# Altium schematic sheet mcu.SchDoc
size 431 x 279 mm
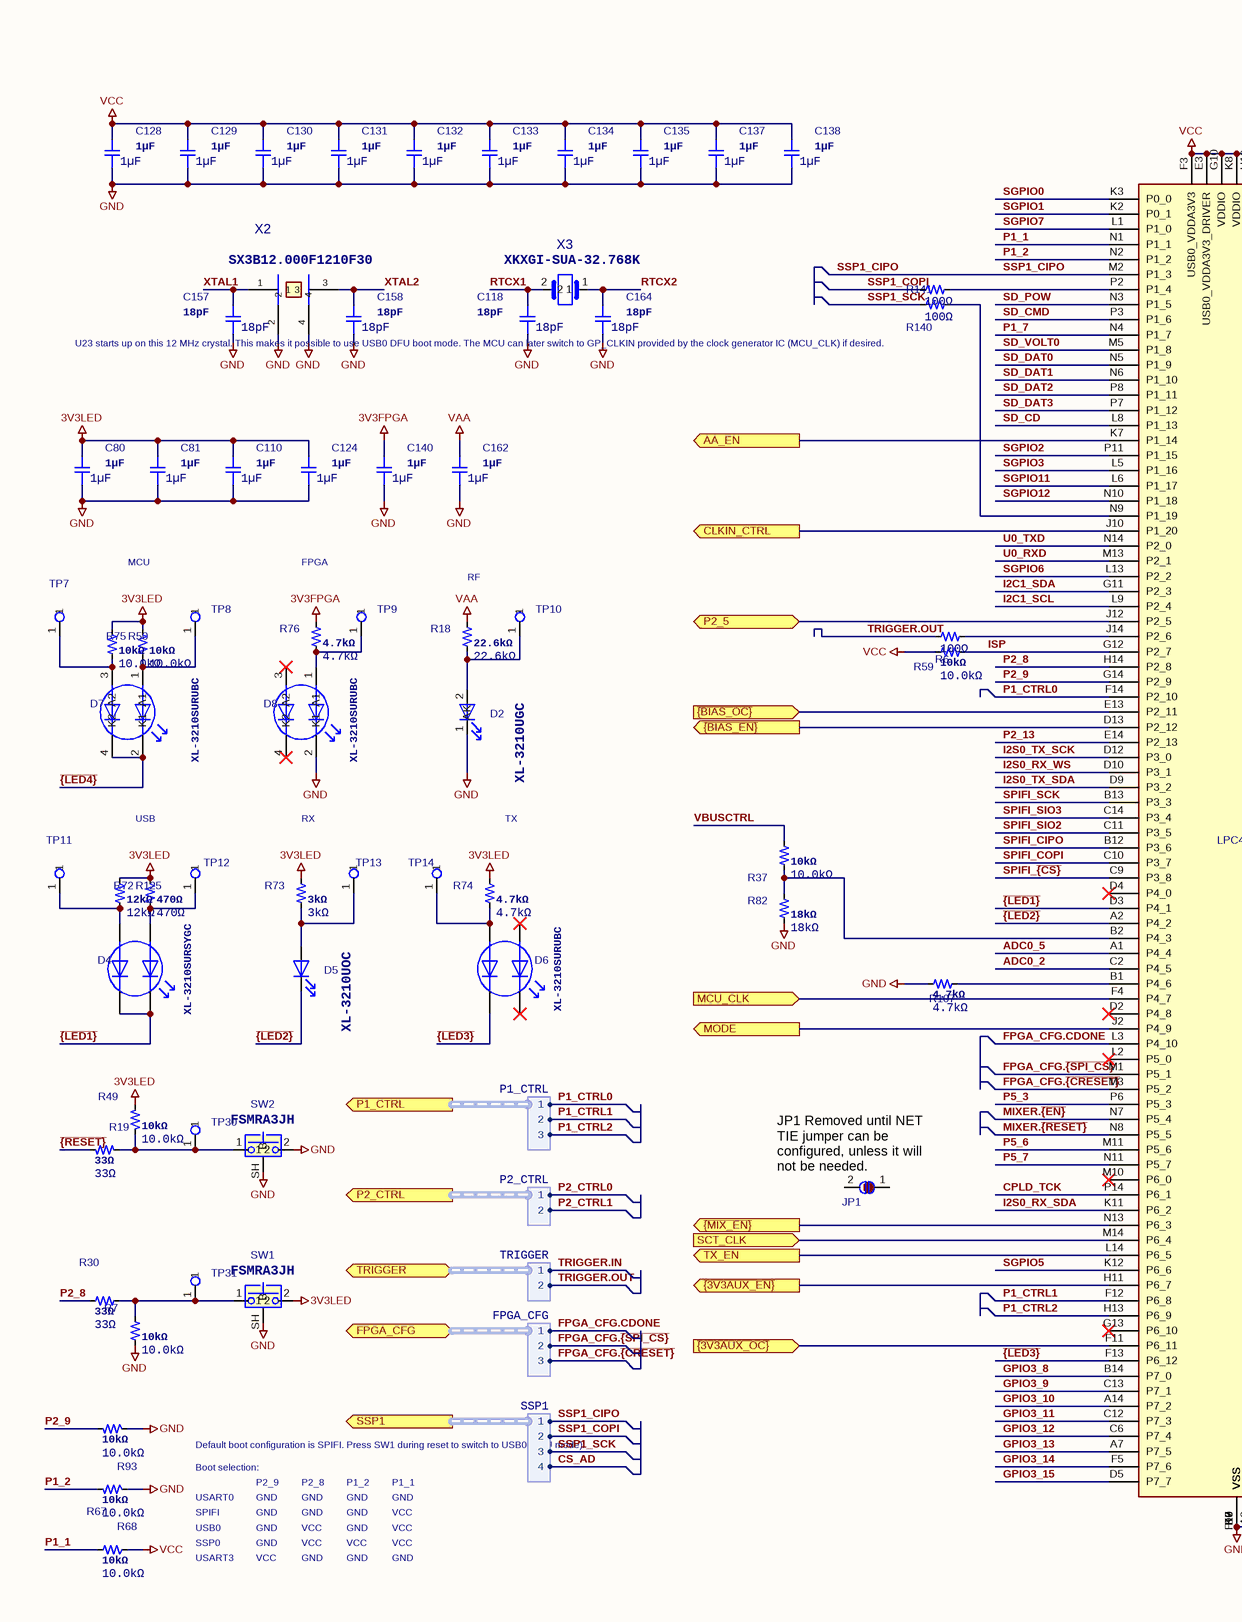
[diagram p0: mcu.SchDoc, left]
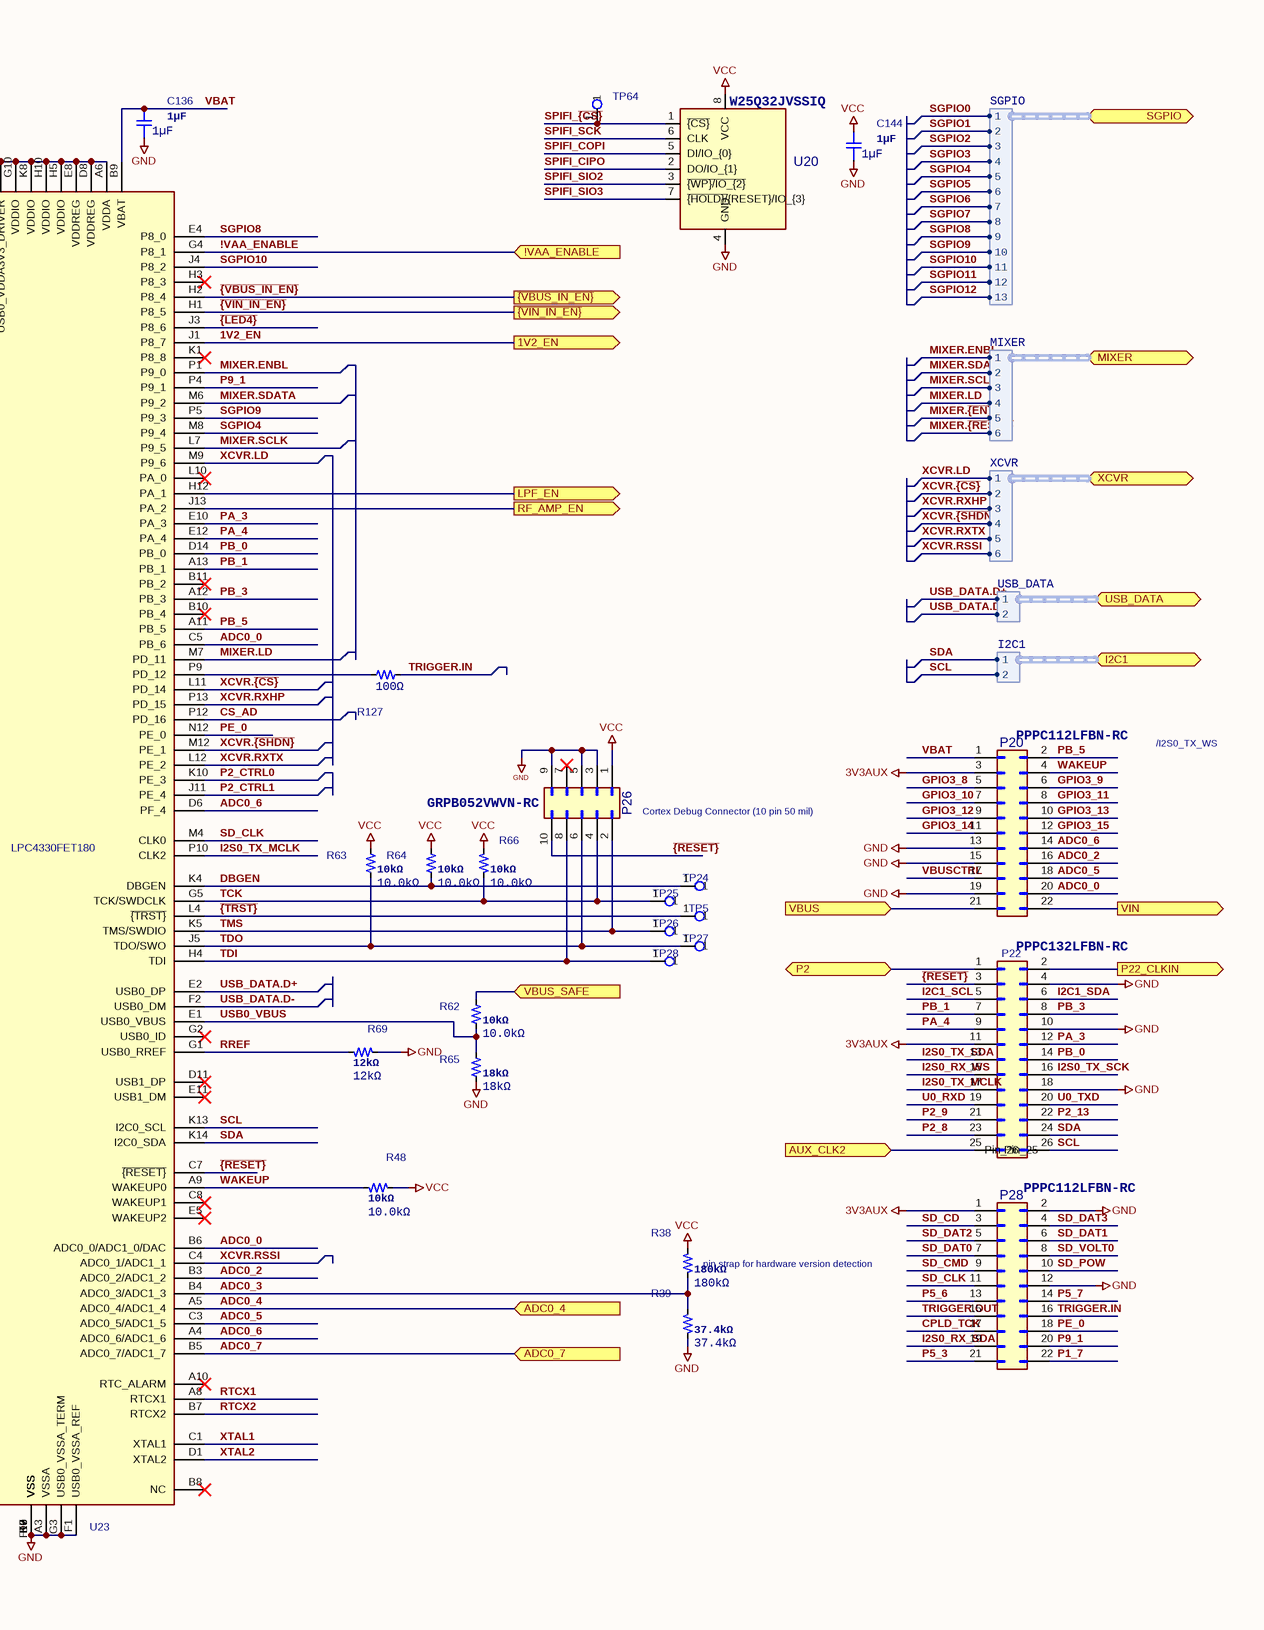
[diagram p1: mcu.SchDoc, right]

## Parts
C80  value 1µF  [CAPC0402(1005)33_L]  (hidden comment: MN-CAP-CERM-X7R-0402-1µF-25V-10%)
C81  value 1µF  [CAPC0402(1005)33_L]  (hidden comment: MN-CAP-CERM-X7R-0402-1µF-25V-10%)
C110  value 1µF  [CAPC0402(1005)33_L]  (hidden comment: MN-CAP-CERM-X7R-0402-1µF-25V-10%)
C118  value 18pF  [CAPC0402(1005)33_L]  (hidden comment: MN-CAP-CERM-C0G-0402-18pF-50V-5%)
C124  value 1µF  [CAPC0402(1005)33_L]  (hidden comment: MN-CAP-CERM-X7R-0402-1µF-25V-10%)
C128  value 1µF  [CAPC0402(1005)33_L]  (hidden comment: MN-CAP-CERM-X7R-0402-1µF-25V-10%)
C129  value 1µF  [CAPC0402(1005)33_L]  (hidden comment: MN-CAP-CERM-X7R-0402-1µF-25V-10%)
C130  value 1µF  [CAPC0402(1005)33_L]  (hidden comment: MN-CAP-CERM-X7R-0402-1µF-25V-10%)
C131  value 1µF  [CAPC0402(1005)33_L]  (hidden comment: MN-CAP-CERM-X7R-0402-1µF-25V-10%)
C132  value 1µF  [CAPC0402(1005)33_L]  (hidden comment: MN-CAP-CERM-X7R-0402-1µF-25V-10%)
C133  value 1µF  [CAPC0402(1005)33_L]  (hidden comment: MN-CAP-CERM-X7R-0402-1µF-25V-10%)
C134  value 1µF  [CAPC0402(1005)33_L]  (hidden comment: MN-CAP-CERM-X7R-0402-1µF-25V-10%)
C135  value 1µF  [CAPC0402(1005)33_L]  (hidden comment: MN-CAP-CERM-X7R-0402-1µF-25V-10%)
C136  value 1µF  [CAPC0402(1005)33_L]  (hidden comment: MN-CAP-CERM-X7R-0402-1µF-25V-10%)
C137  value 1µF  [CAPC0402(1005)33_L]  (hidden comment: MN-CAP-CERM-X7R-0402-1µF-25V-10%)
C138  value 1µF  [CAPC0402(1005)33_L]  (hidden comment: MN-CAP-CERM-X7R-0402-1µF-25V-10%)
C140  value 1µF  [CAPC0402(1005)33_L]  (hidden comment: MN-CAP-CERM-X7R-0402-1µF-25V-10%)
C144  value 1µF  [CAPC0402(1005)33_L]  (hidden comment: MN-CAP-CERM-X7R-0402-1µF-25V-10%)
C157  value 18pF  [CAPC0402(1005)33_L]  (hidden comment: MN-CAP-CERM-C0G-0402-18pF-50V-5%)
C158  value 18pF  [CAPC0402(1005)33_L]  (hidden comment: MN-CAP-CERM-C0G-0402-18pF-50V-5%)
C162  value 1µF  [CAPC0402(1005)33_L]  (hidden comment: MN-CAP-CERM-X7R-0402-1µF-25V-10%)
C164  value 18pF  [CAPC0402(1005)33_L]  (hidden comment: MN-CAP-CERM-C0G-0402-18pF-50V-5%)
D2  Part Number: XL-3210UGC  [LED_Single_Xinglight_XL-3210_Horizontal]  (hidden comment: LED)
D4  Part Number: XL-3210SURSYGC  [LED_Dual_Xinglight_XL-3210_Horizontal]  (hidden comment: LED)
D5  Part Number: XL-3210UOC  [LED_Single_Xinglight_XL-3210_Horizontal]  (hidden comment: LED)
D6  Part Number: XL-3210SURUBC  [LED_Dual_Xinglight_XL-3210_Horizontal]  (hidden comment: LED)
D7  Part Number: XL-3210SURUBC  [LED_Dual_Xinglight_XL-3210_Horizontal]  (hidden comment: LED)
D8  Part Number: XL-3210SURUBC  [LED_Dual_Xinglight_XL-3210_Horizontal]  (hidden comment: LED)
JP1  SolderJumper_2_Bridged  [SolderJumper-2_P1.3mm_Bridged_RoundedPad1.0x1.5mm]  (value not drawn)  (graphical)
P20  Part Number: PPPC112LFBN-RC  [PinSocket_2x11_P2.54mm_Vertical_Flipped]  (hidden comment: HEADER_2x11)
P22  Part Number: PPPC132LFBN-RC  [PinSocket_2x13_P2.54mm_Vertical_Flipped]  (hidden comment: HEADER_2x13)
P26  Part Number: GRPB052VWVN-RC  [PinHeader_2x05_P1.27mm_Vertical]  (hidden comment: LPC_JTAG)
P28  Part Number: PPPC112LFBN-RC  [PinSocket_2x11_P2.54mm_Vertical_Flipped]  (hidden comment: HEADER_2x11)
R6  Resistance: 100Ω  [RESC0201(0603)_N]  (hidden comment: MN-RES-0201-100Ω-1/20W)
R7  value 10kΩ  Resistance: 10.0kΩ  [RESC0402(1005)]  (hidden comment: MN-RES-0402-10.0KΩ-1/5W)
R18  value 22.6kΩ  [RESC0201(0603)_N]  (hidden comment: MN-RES-0201-22.6KΩ-1/20W)
R19  value 33Ω  [RESC0201(0603)_N]  (hidden comment: MN-RES-0201-33Ω-1/20W)
R30  value 33Ω  [RESC0201(0603)_N]  (hidden comment: MN-RES-0201-33Ω-1/20W)
R37  value 10kΩ  Resistance: 10.0kΩ  [RESC0402(1005)]  (hidden comment: MN-RES-0402-10.0KΩ-1/5W)
R38  value 180kΩ  [RESC0402(1005)]  (hidden comment: MN-RES-0402-180KΩ-1/16W)
R39  value 37.4kΩ  [RESC0402(1005)]  (hidden comment: MN-RES-0402-37.4KΩ-1/16W)
R48  value 10kΩ  Resistance: 10.0kΩ  [RESC0402(1005)]  (hidden comment: MN-RES-0402-10.0KΩ-1/5W)
R49  value 10kΩ  Resistance: 10.0kΩ  [RESC0402(1005)]  (hidden comment: MN-RES-0402-10.0KΩ-1/5W)
R50  value 10kΩ  Resistance: 10.0kΩ  [RESC0402(1005)]  (hidden comment: MN-RES-0402-10.0KΩ-1/5W)
R59  value 10kΩ  Resistance: 10.0kΩ  [RESC0402(1005)]  (hidden comment: MN-RES-0402-10.0KΩ-1/5W)
R62  value 10kΩ  Resistance: 10.0kΩ  [RESC0402(1005)]  (hidden comment: MN-RES-0402-10.0KΩ-1/5W)
R63  value 10kΩ  Resistance: 10.0kΩ  [RESC0402(1005)]  (hidden comment: MN-RES-0402-10.0KΩ-1/5W)
R64  value 10kΩ  Resistance: 10.0kΩ  [RESC0402(1005)]  (hidden comment: MN-RES-0402-10.0KΩ-1/5W)
R65  value 18kΩ  [RESC0402(1005)]  (hidden comment: MN-RES-0402-18KΩ-1/16W)
R66  value 10kΩ  Resistance: 10.0kΩ  [RESC0402(1005)]  (hidden comment: MN-RES-0402-10.0KΩ-1/5W)
R67  value 10kΩ  Resistance: 10.0kΩ  [RESC0402(1005)]  (hidden comment: MN-RES-0402-10.0KΩ-1/5W)
R68  value 10kΩ  Resistance: 10.0kΩ  [RESC0402(1005)]  (hidden comment: MN-RES-0402-10.0KΩ-1/5W)
R69  value 12kΩ  [RESC0201(0603)_N]  (hidden comment: MN-RES-0201-12KΩ-1/20W)
R72  value 470Ω  [RESC0201(0603)_N]  (hidden comment: MN-RES-0201-470Ω-1/20W)
R73  value 3kΩ  [RESC0402(1005)]  (hidden comment: MN-RES-0402-3KΩ-1/16W)
R74  value 4.7kΩ  [RESC0201(0603)_N]  (hidden comment: MN-RES-0201-4.7KΩ-1/20W)
R75  value 10kΩ  Resistance: 10.0kΩ  [RESC0402(1005)]  (hidden comment: MN-RES-0402-10.0KΩ-1/5W)
R76  value 4.7kΩ  [RESC0201(0603)_N]  (hidden comment: MN-RES-0201-4.7KΩ-1/20W)
R82  value 18kΩ  [RESC0402(1005)]  (hidden comment: MN-RES-0402-18KΩ-1/16W)
R93  value 10kΩ  Resistance: 10.0kΩ  [RESC0402(1005)]  (hidden comment: MN-RES-0402-10.0KΩ-1/5W)
R107  value 4.7kΩ  [RESC0201(0603)_N]  (hidden comment: MN-RES-0201-4.7KΩ-1/20W)
R125  value 12kΩ  [RESC0201(0603)_N]  (hidden comment: MN-RES-0201-12KΩ-1/20W)
R127  Resistance: 100Ω  [RESC0201(0603)_N]  (hidden comment: MN-RES-0201-100Ω-1/20W)
R140  Resistance: 100Ω  [RESC0201(0603)_N]  (hidden comment: MN-RES-0201-100Ω-1/20W)
R141  Resistance: 100Ω  [RESC0201(0603)_N]  (hidden comment: MN-RES-0201-100Ω-1/20W)
SW1  Part Number: FSMRA3JH  [SW_Tactile_SPST_Angled_PTS645Vx58-2LFS]  (hidden comment: SWITCH)
SW2  Part Number: FSMRA3JH  [SW_Tactile_SPST_Angled_PTS645Vx58-2LFS]  (hidden comment: SWITCH)
TP5  TestPoint  [TestPoint_Pad_D1.0mm]  (value not drawn)
TP7  TestPoint  [TestPoint_Pad_D1.0mm]  (value not drawn)
TP8  TestPoint  [TestPoint_Pad_D1.0mm]  (value not drawn)
TP9  TestPoint  [TestPoint_Pad_D1.0mm]  (value not drawn)
TP10  TestPoint  [TestPoint_Pad_D1.0mm]  (value not drawn)
TP11  TestPoint  [TestPoint_Pad_D1.0mm]  (value not drawn)
TP12  TestPoint  [TestPoint_Pad_D1.0mm]  (value not drawn)
TP13  TestPoint  [TestPoint_Pad_D1.0mm]  (value not drawn)
TP14  TestPoint  [TestPoint_Pad_D1.0mm]  (value not drawn)
TP24  TestPoint  [TestPoint_Pad_D1.0mm]  (value not drawn)
TP25  TestPoint  [TestPoint_Pad_D1.0mm]  (value not drawn)
TP26  TestPoint  [TestPoint_Pad_D1.0mm]  (value not drawn)
TP27  TestPoint  [TestPoint_Pad_D1.0mm]  (value not drawn)
TP28  TestPoint  [TestPoint_Pad_D1.0mm]  (value not drawn)
TP30  TestPoint  [TestPoint_Pad_D1.0mm]  (value not drawn)
TP31  TestPoint  [TestPoint_Pad_D1.0mm]  (value not drawn)
TP64  TestPoint  [TestPoint_Pad_D1.0mm]  (value not drawn)
U20  Part Number: W25Q32JVSSIQ  [SOIC-8_5.3x5.3mm_P1.27mm]  (hidden comment: W25Q32)
U23  LPC4330FET180  [TFBGA-180_12x12mm_Layout14x14_P0.8mm]
X2  Part Number: SX3B12.000F1210F30  [Crystal_SMD_3225-4Pin_3.2x2.5mm]  (hidden comment: MCU_XTAL)
X3  Part Number: XKXGI-SUA-32.768K  [Crystal_SMD_3215-2Pin_3.2x1.5mm]  (hidden comment: RTC_XTAL)

## Ports
1V2_EN (out), !VAA_ENABLE (in), AA_EN (out), ADC0_4 (in), ADC0_7 (in), AUX_CLK2 (in), CLKIN_CTRL (out), FPGA_CFG (bidir, harness FPGA_CFG), I2C1 (bidir, harness I2C1), LPF_EN (out), MCU_CLK (in), MIXER (bidir, harness MIXER), MODE (out), P1_CTRL (out, harness P1_CTRL), P2 (bidir), P2_5 (bidir), P2_CTRL (out, harness P2_CTRL), P22_CLKIN (out), RF_AMP_EN (out), SCT_CLK (in), SGPIO (bidir, harness SGPIO), SSP1 (out, harness SSP1), TRIGGER (bidir, harness TRIGGER), TX_EN (out), USB_DATA (bidir, harness USB_DATA), VBUS (in), VBUS_SAFE (in), VIN (out), XCVR (bidir, harness XCVR), ~{{3V3AUX_EN}} (out), ~{{3V3AUX_OC}} (in), ~{{BIAS_EN}} (out), ~{{BIAS_OC}} (in), ~{{MIX_EN}} (out), ~{{VBUS_IN_EN}} (out), ~{{VIN_IN_EN}} (out)

## Harnesses
XCVR: 1, 5, 4, 3, 2, 6
MIXER: 1, 6, 5, 4, 3, 2
USB_DATA: 1, 2
SGPIO: 1, 5, 4, 3, 2, 13, 7, 8, 11, 9, 12, 10, 6
P1_CTRL: 1, 2, 3
P2_CTRL: 1, 2
TRIGGER: 1, 2
FPGA_CFG: 1, 2, 3
SSP1: 1, 2, 3, 4
I2C1: 1, 2

## Nets
3V3AUX: P20.3(Pin_3) P22.11(Pin_11) P28.1(Pin_1)
3V3FPGA: C140.1 R76.1
3V3LED: C80.1 C81.1 C110.1 C124.1 R49.1 R50.1 R72.1 R73.1 R74.1 R75.1 R125.1 SW1.2
GND: C80.2 C81.2 C110.2 C118.2 C124.2 C128.2 C129.2 C130.2 C131.2 C132.2 C133.2 C134.2 C135.2 C136.2 C137.2 C138.2 C140.2 C144.2 C157.2 C158.2 C162.2 C164.2 D2.1(K) D8.2(K1) P20.13(Pin_13) P20.15(Pin_15) P20.19(Pin_19) P22.4(Pin_4) P22.10(Pin_10) P22.18(Pin_18) P26.3(Pin_3) P26.5(Pin_5) P26.9(Pin_9) P28.2(Pin_2) P28.12(Pin_12) R7.2 R39.2 R65.2 R68.1 R69.1 R82.2 R93.1 R107.1 SW1.SH(B) SW2.2 SW2.SH(B) U20.4(GND) U23.A3(VSSA) U23.D7(VSS) U23.E6(VSS) U23.E7(VSS) U23.E9(VSS) U23.F1(USB0_VSSA_REF) U23.F10(VSS) U23.G3(USB0_VSSA_TERM) U23.K6(VSS) U23.K9(VSS) X2.2 X2.4
VAA: C162.1 R18.1
VCC: C128.1 C129.1 C130.1 C131.1 C132.1 C133.1 C134.1 C135.1 C137.1 C138.1 C144.1 P26.1(Pin_1) R38.1 R48.1 R59.1 R63.1 R64.1 R66.1 R67.2 U20.8(VCC) U23.A6(VDDA) U23.D8(VDDREG) U23.E3(USB0_VDDA3V3_DRIVER) U23.E8(VDDREG) U23.F3(USB0_VDDA3V3) U23.G10(VDDIO) U23.H5(VDDIO) U23.H10(VDDIO) U23.K8(VDDIO)
1V2_EN: U23.J1(P8_7) ; port 1V2_EN
!VAA_ENABLE: U23.G4(P8_1) ; port !VAA_ENABLE
AA_EN: U23.K7(P1_14) ; port AA_EN
ADC0_0: P20.20(Pin_20) U23.B6(ADC0_0/ADC1_0/DAC) U23.C5(PB_6)
ADC0_2: P20.16(Pin_16) U23.B3(ADC0_2/ADC1_2) U23.C2(P4_5)
ADC0_3: R38.2 R39.1 U23.B4(ADC0_3/ADC1_3)
ADC0_4: U23.A5(ADC0_4/ADC1_4) ; port ADC0_4
ADC0_5: P20.18(Pin_18) U23.A1(P4_4) U23.C3(ADC0_5/ADC1_5)
ADC0_6: P20.14(Pin_14) U23.A4(ADC0_6/ADC1_6) U23.D6(PF_4)
ADC0_7: U23.B5(ADC0_7/ADC1_7) ; port ADC0_7
AUX_CLK2: P22.25(Pin_25) ; port AUX_CLK2
CLKIN_CTRL: U23.J10(P1_20) ; port CLKIN_CTRL
CPLD_TCK: P28.17(Pin_17) U23.P14(P6_1)
CS_AD: U23.P12(PD_16) ; port SSP1.4
DBGEN: R64.2 TP24.1 U23.K4(DBGEN)
FPGA_CFG.CDONE: U23.L3(P4_10) ; port FPGA_CFG.1
FPGA_CFG.~{{CRESET}}: U23.M3(P5_2) ; port FPGA_CFG.3
FPGA_CFG.~{{SPI_CS}}: U23.M1(P5_1) ; port FPGA_CFG.2
GPIO3_8: P20.5(Pin_5) U23.B14(P7_0)
GPIO3_9: P20.6(Pin_6) U23.C13(P7_1)
GPIO3_10: P20.7(Pin_7) U23.A14(P7_2)
GPIO3_11: P20.8(Pin_8) U23.C12(P7_3)
GPIO3_12: P20.9(Pin_9) U23.C6(P7_4)
GPIO3_13: P20.10(Pin_10) U23.A7(P7_5)
GPIO3_14: P20.11(Pin_11) U23.F5(P7_6)
GPIO3_15: P20.12(Pin_12) U23.D5(P7_7)
I2C1_SCL: P22.5(Pin_5) U23.L9(P2_4)
I2C1_SDA: P22.6(Pin_6) U23.G11(P2_3)
I2S0_RX_SDA: P28.19(Pin_19) U23.K11(P6_2)
I2S0_RX_WS: P22.15(Pin_15) U23.D10(P3_1)
I2S0_TX_MCLK: P22.17(Pin_17) U23.P10(CLK2)
I2S0_TX_SCK: P22.16(Pin_16) U23.D12(P3_0)
I2S0_TX_SDA: P22.13(Pin_13) U23.D9(P3_2)
ISP: R59.2 U23.G12(P2_7)
LPF_EN: U23.H12(PA_1) ; port LPF_EN
MCU_CLK: U23.F4(P4_7) ; port MCU_CLK
MIXER.ENBL: U23.P1(P9_0) ; port MIXER.1
MIXER.LD: U23.M7(PD_11) ; port MIXER.4
MIXER.SCLK: U23.L7(P9_5) ; port MIXER.3
MIXER.SDATA: U23.M6(P9_2) ; port MIXER.2
MIXER.~{{EN}}: U23.N7(P5_4) ; port MIXER.5
MIXER.~{{RESET}}: U23.N8(P5_5) ; port MIXER.6
MODE: U23.J2(P4_9) ; port MODE
P1_1: R67.1 U23.N1(P1_1)
P1_2: R68.2 U23.N2(P1_2)
P1_7: P28.22(Pin_22) U23.N4(P1_7)
P1_CTRL0: U23.F14(P2_10) ; port P1_CTRL.1
P1_CTRL1: U23.F12(P6_8) ; port P1_CTRL.2
P1_CTRL2: U23.H13(P6_9) ; port P1_CTRL.3
P2: P22.1(Pin_1) ; port P2
P2_5: U23.J12(P2_5) ; port P2_5
P2_8: P22.23(Pin_23) R30.1 U23.H14(P2_8)
P2_9: P22.21(Pin_21) R93.2 U23.G14(P2_9)
P2_13: P22.22(Pin_22) U23.E14(P2_13)
P2_CTRL0: U23.K10(PE_3) ; port P2_CTRL.1
P2_CTRL1: U23.J11(PE_4) ; port P2_CTRL.2
P5_3: P28.21(Pin_21) U23.P6(P5_3)
P5_6: P28.13(Pin_13) U23.M11(P5_6)
P5_7: P28.14(Pin_14) U23.N11(P5_7)
P9_1: P28.20(Pin_20) U23.P4(P9_1)
P22_CLKIN: P22.2(Pin_2) ; port P22_CLKIN
PA_3: P22.12(Pin_12) U23.E10(PA_3)
PA_4: P22.9(Pin_9) U23.E12(PA_4)
PB_0: P22.14(Pin_14) U23.D14(PB_0)
PB_1: P22.7(Pin_7) U23.A13(PB_1)
PB_3: P22.8(Pin_8) U23.A12(PB_3)
PB_5: P20.2(Pin_2) U23.A11(PB_5)
PE_0: P28.18(Pin_18) U23.N12(PE_0)
RF_AMP_EN: U23.J13(PA_2) ; port RF_AMP_EN
RREF: R69.2 U23.G1(USB0_RREF)
RTCX1: C118.1 U23.A8(RTCX1) X3.2
RTCX2: C164.1 U23.B7(RTCX2) X3.1
SCL: P22.26(Pin_26) U23.K13(I2C0_SCL) ; port I2C1.2
SCT_CLK: U23.M14(P6_4) ; port SCT_CLK
SD_CD: P28.3(Pin_3) U23.L8(P1_13)
SD_CLK: P28.11(Pin_11) U23.M4(CLK0)
SD_CMD: P28.9(Pin_9) U23.P3(P1_6)
SD_DAT0: P28.7(Pin_7) U23.N5(P1_9)
SD_DAT1: P28.6(Pin_6) U23.N6(P1_10)
SD_DAT2: P28.5(Pin_5) U23.P8(P1_11)
SD_DAT3: P28.4(Pin_4) U23.P7(P1_12)
SD_POW: P28.10(Pin_10) U23.N3(P1_5)
SD_VOLT0: P28.8(Pin_8) U23.M5(P1_8)
SDA: P22.24(Pin_24) U23.K14(I2C0_SDA) ; port I2C1.1
SGPIO0: U23.K3(P0_0) ; port SGPIO.1
SGPIO1: U23.K2(P0_1) ; port SGPIO.2
SGPIO2: U23.P11(P1_15) ; port SGPIO.3
SGPIO3: U23.L5(P1_16) ; port SGPIO.4
SGPIO4: U23.M8(P9_4) ; port SGPIO.5
SGPIO5: U23.K12(P6_6) ; port SGPIO.6
SGPIO6: U23.L13(P2_2) ; port SGPIO.7
SGPIO7: U23.L1(P1_0) ; port SGPIO.8
SGPIO8: U23.E4(P8_0) ; port SGPIO.9
SGPIO9: U23.P5(P9_3) ; port SGPIO.10
SGPIO10: U23.J4(P8_2) ; port SGPIO.11
SGPIO11: U23.L6(P1_17) ; port SGPIO.12
SGPIO12: U23.N10(P1_18) ; port SGPIO.13
SPIFI_CIPO: U20.2(DO/IO_{1}) U23.B12(P3_6)
SPIFI_COPI: U20.5(DI/IO_{0}) U23.C10(P3_7)
SPIFI_SCK: U20.6(CLK) U23.B13(P3_3)
SPIFI_SIO2: U20.3(~{{WP}/IO_{2}}) U23.C11(P3_5)
SPIFI_SIO3: U20.7(~{{HOLD}/}{RESET}/IO_{3}) U23.C14(P3_4)
SPIFI_~{{CS}}: TP64.1 U20.1(~{{CS}}) U23.C9(P3_8)
SSP1_CIPO: U23.M2(P1_3) ; port SSP1.1
SSP1_COPI: R140.1 ; port SSP1.2
SSP1_SCK: R141.1 ; port SSP1.3
TCK: P26.4(Pin_4) R66.2 TP25.1 U23.G5(TCK/SWDCLK)
TDI: P26.8(Pin_8) TP28.1 U23.H4(TDI)
TDO: P26.6(Pin_6) R63.2 TP27.1 U23.J5(TDO/SWO)
TMS: P26.2(Pin_2) TP26.1 U23.K5(TMS/SWDIO)
TRIGGER.IN: P28.16(Pin_16) R127.2 ; port TRIGGER.1
TRIGGER.OUT: P28.15(Pin_15) R6.1 ; port TRIGGER.2
TX_EN: U23.L14(P6_5) ; port TX_EN
U0_RXD: P22.19(Pin_19) U23.M13(P2_1)
U0_TXD: P22.20(Pin_20) U23.N14(P2_0)
USB0_VBUS: R62.2 R65.1 U23.E1(USB0_VBUS)
USB_DATA.D+: U23.E2(USB0_DP) ; port USB_DATA.1
USB_DATA.D-: U23.F2(USB0_DM) ; port USB_DATA.2
VBAT: C136.1 P20.1(Pin_1) U23.B9(VBAT)
VBUS: P20.21(Pin_21) ; port VBUS
VBUS_SAFE: R62.1 ; port VBUS_SAFE
VBUSCTRL: P20.17(Pin_17) R37.1
VIN: P20.22(Pin_22) ; port VIN
WAKEUP: P20.4(Pin_4) R48.2 U23.A9(WAKEUP0)
XCVR.LD: U23.M9(P9_6) ; port XCVR.1
XCVR.RSSI: U23.C4(ADC0_1/ADC1_1) ; port XCVR.6
XCVR.RXHP: U23.P13(PD_15) ; port XCVR.3
XCVR.RXTX: U23.L12(PE_2) ; port XCVR.5
XCVR.~{{CS}}: U23.L11(PD_14) ; port XCVR.2
XCVR.~{{SHDN}}: U23.M12(PE_1) ; port XCVR.4
XTAL1: C157.1 U23.C1(XTAL1) X2.1
XTAL2: C158.1 U23.D1(XTAL2) X2.3
~{{3V3AUX_EN}}: U23.H11(P6_7) ; port ~{{3V3AUX_EN}}
~{{3V3AUX_OC}}: U23.F11(P6_11) ; port ~{{3V3AUX_OC}}
~{{BIAS_EN}}: U23.D13(P2_12) ; port ~{{BIAS_EN}}
~{{BIAS_OC}}: U23.E13(P2_11) ; port ~{{BIAS_OC}}
~{{LED1}}: D4.2(K1) D4.4(K2) U23.D3(P4_1)
~{{LED2}}: D5.1(K) U23.A2(P4_2)
~{{LED3}}: D6.4(K2) U23.F13(P6_12)
~{{LED4}}: D7.2(K1) D7.4(K2) U23.J3(P8_6)
~{{MIX_EN}}: U23.N13(P6_3) ; port ~{{MIX_EN}}
~{{RESET}}: P22.3(Pin_3) P26.10(Pin_10) R19.2 U23.C7(~{{RESET}})
~{{TRST}}: TP5.1 U23.L4(~{{TRST}})
~{{VBUS_IN_EN}}: U23.H2(P8_4) ; port ~{{VBUS_IN_EN}}
~{{VIN_IN_EN}}: U23.H1(P8_5) ; port ~{{VIN_IN_EN}}
NetD2_2: D2.2(A) R18.2 TP10.1
NetD4_1: D4.1(A1) R72.2 TP12.1
NetD4_3: D4.3(A2) R125.2 TP11.1
NetD5_2: D5.2(A) R73.2 TP13.1
NetD6_3: D6.3(A2) R74.2 TP14.1
NetD7_1: D7.1(A1) R75.2 TP8.1
NetD7_3: D7.3(A2) R50.2 TP7.1
NetD8_1: D8.1(A1) R76.2 TP9.1
NetR6_2: R6.2 U23.J14(P2_6)
NetR7_1: R7.1 R30.2 SW1.1 TP31.1
NetR19_1: R19.1 R49.2 SW2.1 TP30.1
NetR37_2: R37.2 R82.1 U23.B2(P4_3)
NetR107_2: R107.2 U23.B1(P4_6)
NetR127_1: R127.1 U23.P9(PD_12)
NetR140_2: R140.2 U23.P2(P1_4)
NetR141_2: R141.2 U23.N9(P1_19)

Not connected (* = marked no-connect by the designer): D6 1(A1)* 2(K1)*; D8 3(A2)* 4(K2)*; JP1 1(A) 2(B); P26 7(Pin_7)*; U23 A10(RTC_ALARM)* B8(NC)* B10(PB_4)* B11(PB_2)* C8(WAKEUP1)* D2(P4_8)* D4(P4_0)* D11(USB1_DP)* E5(WAKEUP2)* E11(USB1_DM)* G2(USB0_ID)* G13(P6_10)* H3(P8_3)* K1(P8_8)* L2(P5_0)* L10(PA_0)* M10(P6_0)*

## Notes on the sheet
- U23 starts up on this 12 MHz
  crystal. This makes it possible
  to use USB0 DFU boot mode.
  The MCU can later switch
  to GP_CLKIN provided by the
  clock generator IC (MCU_CLK)
  if desired.
- MCU
- FPGA
- RF
- /I2S0_TX_WS
- USB
- RX
- TX
- (near P26) Cortex Debug
  Connector
  (10 pin 50 mil)
- (near JP1) JP1 Removed until NET TIE jumper can be configured, unless it will not be needed.
- (near R38) pin strap for hardware
  version detection
- Default boot configuration is SPIFI.
  Press SW1 during reset to switch to
  USB0 (DFU mode).
- USB0
- Boot selection:
- USART0
- SPIFI
- GND
- P2_9
- P2_8
- VCC
- P1_2
- P1_1
- SSP0
- USART3
- 1
- 2
- 3
- 4
- 5
- 6
- 7
- 8
- A
- B
- C
- D
- E
- ${LICENSE}
- Title: ${TITLE}
- File: mcu.kicad_sch
- Sheet: /
- ${COPYRIGHT}
- KiCad E.D.A.  kicad (5.1.4)-1
- Size: User
- Date: ${DATE}
- Rev: ${VERSION}
- Id: 1/1

## Library data of the parts
C80 C81 C110 C124 C128-C138 C140 C144 C162 = CMP-001-00114-1: CAP, CERM, 1 µF, 25 V, +/-10%, 0402, X7R; PartNumber: GRM155R61E105KA12D; Material: Ceramic; Voltage Rating (DC): 25V; Tolerance: 10%; Dielectric: X5R; Capacitance: 1µF; Min Operating Temperature: -55°C; Case Code (Imperial): 0402; Max Operating Temperature: 85°C; Thickness: 500µm; Case Code (Metric): 1005; Voltage: 25V; Depth: 500µm; Width: 500µm; Mounting Technology: Surface Mount; Dielectric Material: Ceramic; Height: 500µm; Length: 1mm; Case/Package: 0402; Voltage Rating: 25V
C118 C157 C158 C164 = CMP-001-00117-2: CAP, CERM, 18 pF, 50 V, +/-5%, 0402, C0G; PartNumber: CGA2B2NP01H220J050BA; Tolerance: 5%; Temperature Coefficient: 30ppm/°C; Voltage Rating (DC): 50V; Material: Ceramic; Capacitance: 18pF; Termination: SMD/SMT; Case Code (Imperial): 0402; Mounting Technology: Surface Mount; Dielectric: C0G; Height: 500µm; Thickness: 500µm; Max Operating Temperature: 125°C; Voltage: 50V; Case Code (Metric): 1005; Case/Package: 0402; Voltage Rating: 50V; Width: 500µm; Min Operating Temperature: -55°C; Length: 1mm
D2 D5 = LED: Manufacturer: Xinglight; Sim.Pins: 1=K 2=A; Value: LED; Footprint: praline:LED_Single_Xinglight_XL-3210_Horizontal
D4 D6-D8 = LED_Dual_AKAK: Manufacturer: Xinglight; Value: LED; Footprint: praline:LED_Dual_Xinglight_XL-3210_Horizontal
P20 P28 = Conn_02x11_Odd_Even: Manufacturer: Sullins; Value: HEADER_2x11; Footprint: praline:PinSocket_2x11_P2.54mm_Vertical_Flipped
P22 = Conn_02x13_Odd_Even: Manufacturer: Sullins; Value: HEADER_2x13; Footprint: praline:PinSocket_2x13_P2.54mm_Vertical_Flipped
P26 = Conn_02x05_Odd_Even: Manufacturer: Sullins; Value: LPC_JTAG; Footprint: Connector_PinHeader_1.27mm:PinHeader_2x05_P1.27mm_Vertical
R6 R127 R140 R141 = CMP-009-00216-3: Resistor, 100Ω, 1%, 1/20W (50mW), 0201; PartNumber: RC0201JR-13100RL; Working Voltage: 25V; Tolerance: 5%; Temperature Coefficient: 200ppm/°C; Mounting Technology: Surface Mount; Case/Package: 0201; Number of Terminals: 2; Height: 230µm; Width: 300µm; Power Rating: 50mW; Min Operating Temperature: -55°C; Length: 600µm; Max Operating Temperature: 125°C; Value: 100Ω
R7 R37 R48-R50 R59 R62-R64 R66-R68 R75 R93 = CMP-009-00178-11: Resistor, 10.0KΩ, 1%, 1/5W (200mW), 0402; PartNumber: CRCW040210K0FKEDHP; Voltage Rating: 50V; Length: 1mm; Tolerance: 1%; Composition: Thick Film; Case Code (Imperial): 0402; Height: 300µm; Power Rating: 200mW; Case Code (Metric): 1005; Width: 500µm; Case/Package: 0402; Mounting Technology: Surface Mount
R18 = CMP-009-00219-2: Resistor, 22.6KΩ, 1%, 1/20W (50mW), 0201; PartNumber: RC0201JR-13100RL; Temperature Coefficient: 200ppm/°C; Working Voltage: 25V; Resistance: 22.6kΩ; Max Power Dissipation: 50mW; Power Rating: 50mW; Depth: 300µm; Number of Terminals: 2; Case Code (Metric): 0603; Contact Plating: Tin; Max Operating Temperature: 125°C; Length: 600µm; Voltage Rating: 25V; Number of Terminations: 2; Case/Package: 0201; Voltage Rating (DC): 25V; Case Code (Imperial): 0201; Composition: Thick Film; Termination: SMD/SMT; Width: 300µm; Height: 230µm; Min Operating Temperature: -55°C; Mounting Technology: Surface Mount; Tolerance: 1%
R19 R30 = CMP-009-00218-2: Resistor, 33Ω, 1%, 1/20W (50mW), 0201; PartNumber: RC0201JR-13100RL; Tolerance: 5%; Voltage Rating (DC): 25V; Temperature Coefficient: 200ppm/°C; Resistance: 33Ω; Contact Plating: Tin; Max Power Dissipation: 50mW; Number of Terminals: 2; Max Operating Temperature: 125°C; Termination: SMD/SMT; Length: 600µm; Working Voltage: 25V; Min Operating Temperature: -55°C; Voltage Rating: 25V; Width: 300µm; Composition: Thick Film; Power Rating: 50mW; Case Code (Metric): 0603; Number of Terminations: 2; Depth: 300µm; Mounting Technology: Surface Mount; Case Code (Imperial): 0201; Height: 230µm; Case/Package: 0201
R38 = CMP-009-00224-3: Resistor, 180KΩ, 1%, 1/16W (66mW), 0402; PartNumber: RC0402FR-07180KL; Voltage Rating (AC): 50V; Power Rating: 62.5mW; Temperature Coefficient: 100ppm/°C; Max Power Dissipation: 63mW; Tolerance: 1%; Resistance: 180kΩ; Depth: 500µm; Termination: SMD/SMT; Features: Moisture Resistant; Contact Plating: Lead, Tin; Case Code (Imperial): 0402; Voltage Rating: 50V; Min Operating Temperature: -55°C; Max Operating Temperature: 155°C; Working Voltage: 50V; Ratings: AEC-Q200; Composition: Thick Film; Width: 500µm; Voltage Rating (DC): 50V; Length: 1mm; Height: 350µm; Mounting Technology: Surface Mount; Case Code (Metric): 0402; Case/Package: 0402
R39 = CMP-009-00225-2: Resistor, 37.4KΩ, 1%, 1/16W (66mW), 0402; PartNumber: RC0402FR-0737K4L; Max Power Dissipation: 63mW; Voltage Rating: 50V; Power Rating: 62.5mW; Tolerance: 1%; Resistance: 37.4kΩ; Length: 1mm; Composition: Thick Film; Height: 350µm; Mounting Technology: Surface Mount; Termination: SMD/SMT; Min Operating Temperature: -55°C; Number of Terminals: 2; Contact Plating: Tin; Width: 500µm; Case Code (Metric): 1005; Depth: 500µm; Voltage Rating (DC): 50V; Case Code (Imperial): 0402; Case/Package: 0402; Features: Moisture Resistant; Working Voltage: 50V; Number of Terminations: 2; Max Operating Temperature: 155°C
R65 R82 = CMP-009-00223-2: Resistor, 18KΩ, 5%, 1/16W (66mW), 0402; PartNumber: RC0402JR-0718KL; Working Voltage: 50V; Max Power Dissipation: 63mW; Power Rating: 62.5mW; Temperature Coefficient: 100ppm/°C; Resistance: 18kΩ; Termination: SMD/SMT; Features: Moisture Resistant; Max Operating Temperature: 155°C; Case Code (Imperial): 0402; Min Operating Temperature: -55°C; Composition: Thick Film; Mounting Technology: Surface Mount; Voltage Rating (DC): 50V; Contact Plating: Lead, Tin; Length: 1mm; Case/Package: 0402; Height: 350µm; Depth: 500µm; Voltage Rating: 50V; Tolerance: 5%; Case Code (Metric): 1005; Ratings: AEC-Q200; Width: 500µm
R69 R125 = CMP-009-00221-2: Resistor, 12KΩ, 1%, 1/20W (50mW), 0201; PartNumber: RC0201FR-0712KL; Working Voltage: 25V; Temperature Coefficient: 200ppm/°C; Tolerance: 1%; Resistance: 12kΩ; Power Rating: 50mW; Mounting Technology: Surface Mount; Min Operating Temperature: -55°C; Max Operating Temperature: 125°C; Height: 230µm; Number of Terminals: 2; Case/Package: 0201; Number of Terminations: 2; Voltage Rating: 25V; Length: 600µm; Max Power Dissipation: 50mW; Width: 300µm; Case Code (Imperial): 0201; Case Code (Metric): 0603; Contact Plating: Tin; Composition: Thick Film; Voltage Rating (DC): 25V; Depth: 300µm; Termination: SMD/SMT
R72 = CMP-009-00222-2: Resistor, 470Ω, 1%, 1/20W (50mW), 0201; PartNumber: RC0201JR-07470RL; Tolerance: 5%; Voltage Rating: 25V; Temperature Coefficient: 200ppm/°C; Resistance: 470Ω; Number of Terminations: 2; Power Rating: 50mW; Height: 230µm; Pins: 2; Min Operating Temperature: -55°C; Max Operating Temperature: 125°C; Features: Moisture Resistant; Length: 600µm; Case Code (Metric): 0603; Width: 300µm; Number of Terminals: 2; Composition: Thick Film; Working Voltage: 25V; Depth: 300µm; Case/Package: 0201; Max Power Dissipation: 50mW; Termination: SMD/SMT; Voltage Rating (DC): 25V; Mounting Technology: Surface Mount; Case Code (Imperial): 0201
R73 = CMP-009-00220-2: Resistor, 3KΩ, 1%, 1/16W (66mW), 0402; PartNumber: CRCW04023R32FKED; Power Dissipation: 63mW; Working Voltage: 50V; Tolerance: 5%; Power Rating: 62.5mW; Temperature Coefficient: 100ppm/°C; Resistance: 3kΩ; Min Operating Temperature: -55°C; Length: 1mm; Termination: SMD/SMT; Height: 350µm; Voltage Rating (DC): 50V; Number of Terminals: 2; Max Operating Temperature: 155°C; Case Code (Imperial): 0402; Case/Package: 0402; Voltage Rating: 50V; Features: Automotive AEC-Q200; Composition: Thick Film; Depth: 500µm; Mounting Technology: Surface Mount; Width: 500µm; Max Power Dissipation: 63mW; Case Code (Metric): 1005
R74 R76 R107 = CMP-009-00217-2: Resistor, 4.7KΩ, 1%, 1/20W (50mW), 0201; PartNumber: RC0201JR-13100RL; Working Voltage: 25V; Temperature Coefficient: 200ppm/°C; Resistance: 4.7kΩ; Case Code (Metric): 0603; Case/Package: 0201; Max Operating Temperature: 125°C; Contact Plating: Tin; Case Code (Imperial): 0201; Tolerance: 1%; Max Power Dissipation: 50mW; Number of Terminals: 2; Min Operating Temperature: -55°C; Number of Terminations: 2; Composition: Thick Film; Height: 230µm; Length: 600µm; Power Rating: 50mW; Voltage Rating: 25V; Depth: 300µm; Mounting Technology: Surface Mount; Voltage Rating (DC): 25V; Width: 300µm; Termination: SMD/SMT
SW1 SW2 = SW_Push_Shielded: Manufacturer: TE Connectivity; Value: SWITCH; Footprint: praline:SW_Tactile_SPST_Angled_PTS645Vx58-2LFS
U20 = W25Q32JVSS: Manufacturer: Winbond; Value: W25Q32; Footprint: Package_SO:SOIC-8_5.3x5.3mm_P1.27mm
U23 = LPC43xxFET180: Manufacturer: NXP; Substitution: LPC4350FET180; Part Number: LPC4330FET180; Value: LPC4330FET180; Footprint: praline:TFBGA-180_12x12mm_Layout14x14_P0.8mm
X2 = GSG-XTAL4PIN: Manufacturer: Shenzhen SCTF Electronics; Value: MCU_XTAL; Footprint: praline:Crystal_SMD_3225-4Pin_3.2x2.5mm
X3 = Crystal: Manufacturer: YXC; Value: RTC_XTAL; Footprint: praline:Crystal_SMD_3215-2Pin_3.2x1.5mm
JP1 = SolderJumper_2_Bridged: Value: SolderJumper_2_Bridged; Footprint: Jumper:SolderJumper-2_P1.3mm_Bridged_RoundedPad1.0x1.5mm
TP5 TP7-TP14 TP24-TP28 TP30 TP31 TP64 = TestPoint: Value: TestPoint; Footprint: TestPoint:TestPoint_Pad_D1.0mm